# Altium schematic sheet speaker.SchDoc
size A
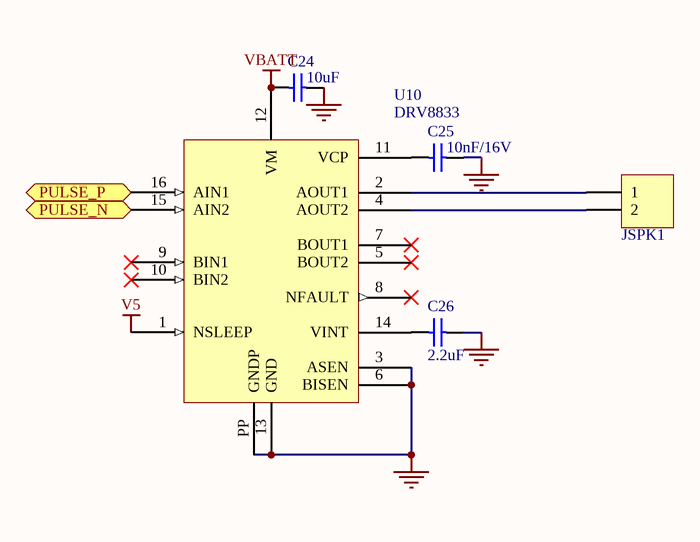
[diagram p0: speaker.SchDoc]

## Parts
C24  10uF  [CAPC3216L]
C25  10nF/16V  [CAPC2012L]
C26  2.2uF  [CAPC2012L]
JSPK1  HDR1X2H  [HDR1X2H]  (value not drawn)
U10  DRV8833  [DRV8833]

## Ports
PULSE_N (in), PULSE_P (in)

## Nets
GND: C24.1 C25.1 C26.1 U10.3(ASEN) U10.6(BISEN) U10.13(GND) U10.PP(GNDP)
V5: U10.1(NSLEEP)
VBATT: C24.2 U10.12(VM)
PULSE_N: U10.15(AIN2) ; port PULSE_N
PULSE_P: U10.16(AIN1) ; port PULSE_P
NetC25_2: C25.2 U10.11(VCP)
NetC26_2: C26.2 U10.14(VINT)
NetJSPK1_1: JSPK1.1 U10.2(AOUT1)
NetJSPK1_2: JSPK1.2 U10.4(AOUT2)

Not connected (* = marked no-connect by the designer): U10 5(BOUT2)* 7(BOUT1)* 8(NFAULT)* 9(BIN1)* 10(BIN2)*

## Library data of the parts
C24-C26 = Cap: Capacitor; Published: 8-Jun-2000; LatestRevisionDate: 17-Jul-2002; LatestRevisionNote: Re-released for DXP Platform.; PackageReference: RAD-0.3; Publisher: Altium Limited; PackageDescription: Radial Cap, Thru-Hole; 2 Leads; 0.3 in Pin Spacing
  C24: Value: 10uF
  C25: Value: 10nF/16V
  C26: Value: 2.2uF
JSPK1 = Header 2: Header, 2-Pin; LatestRevisionDate: 17-Jul-2002; LatestRevisionNote: Re-released for DXP Platform.; Publisher: Altium Limited